# EAGLE design sdadapter (EAGLE 9.6.2)
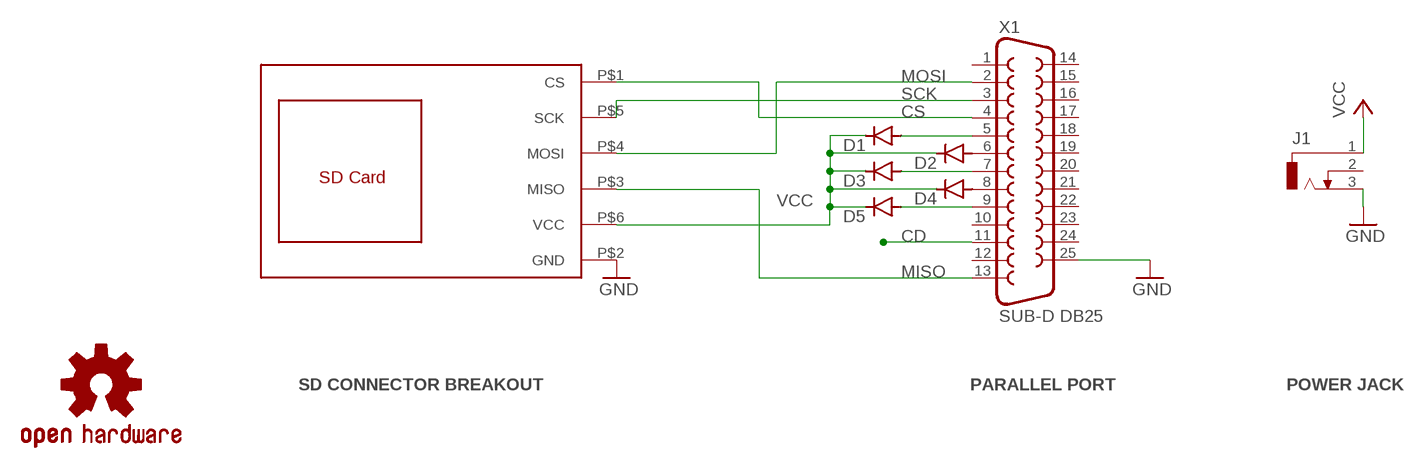
[diagram p0: schematic, sheet 1]

## Parts
D1  CGRM4001-G  [SOD-123_MINI-SMA]
D2  CGRM4001-G  [SOD-123_MINI-SMA]
D3  CGRM4001-G  [SOD-123_MINI-SMA]
D4  CGRM4001-G  [SOD-123_MINI-SMA]
D5  CGRM4001-G  [SOD-123_MINI-SMA]
J1  DCJ0303  [DCJ0303]
LOGO2  OSHW-LOGOS  [OSHW-LOGO-S]
U$1  SD_ADAPTER  [DEBO_MICRO_SD]
X1  SUB-D DB25  F25D  [F25D]

## Nets
CD: X1.11
CS: U$1.P$1(CS) X1.4
GND: J1.3 U$1.P$2(GND) X1.25
MISO: U$1.P$3(MISO) X1.13
MOSI: U$1.P$4(MOSI) X1.2
N$1: D1.A X1.5
N$2: D2.A X1.6
N$3: D3.A X1.7
N$4: D4.A X1.8
N$5: D5.A X1.9
SCK: U$1.P$5(SCK) X1.3
VCC: D1.C D2.C D3.C D4.C D5.C J1.1 U$1.P$6(VCC)
Unconnected: J1.2 X1.1 X1.10 X1.12 X1.14 X1.15 X1.16 X1.17 X1.18 X1.19 X1.20 X1.21 X1.22 X1.23 X1.24

## Notes on the sheet
- SD CONNECTOR BREAKOUT | PARALLEL PORT | POWER JACK

## Library data of the parts
D1-D5 = diode:CGRM400*-G: Molded plasitc,JEDEC SOD-123/Mini SMA Source: Comchip CGRM4001-G.pdf
J1 = con-jack:DCJ0303: DC POWER JACK Source: DCJ0303.pdf; OC_FARNELL: unknown; OC_NEWARK: unknown
LOGO2 = SparkFun-Aesthetics:OSHW-LOGO: Open Source Hardware Logo This logo indicates the piece of hardware it is found on incorporates a OSHW license and/or adheres to the definition of open source hardware found here: http://freedomdefined.org/OSHW
U$1 = sd_adapter:SD_ADAPTER
X1 = con-subd:F25: SUB-D; OC_FARNELL: unknown; OC_NEWARK: unknown

## Board
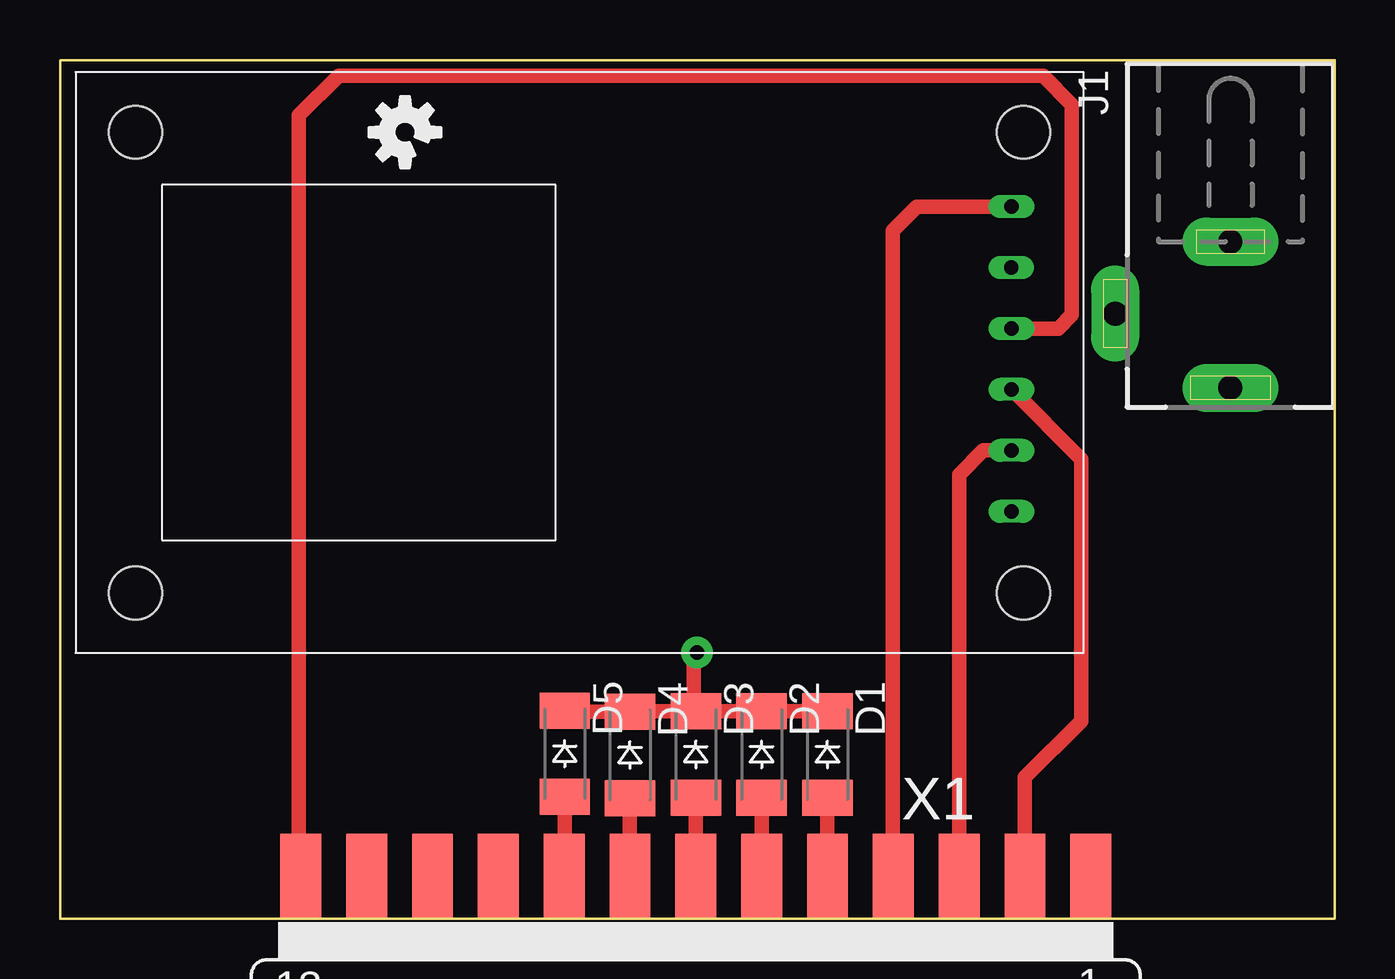
[diagram p1: board, top side]
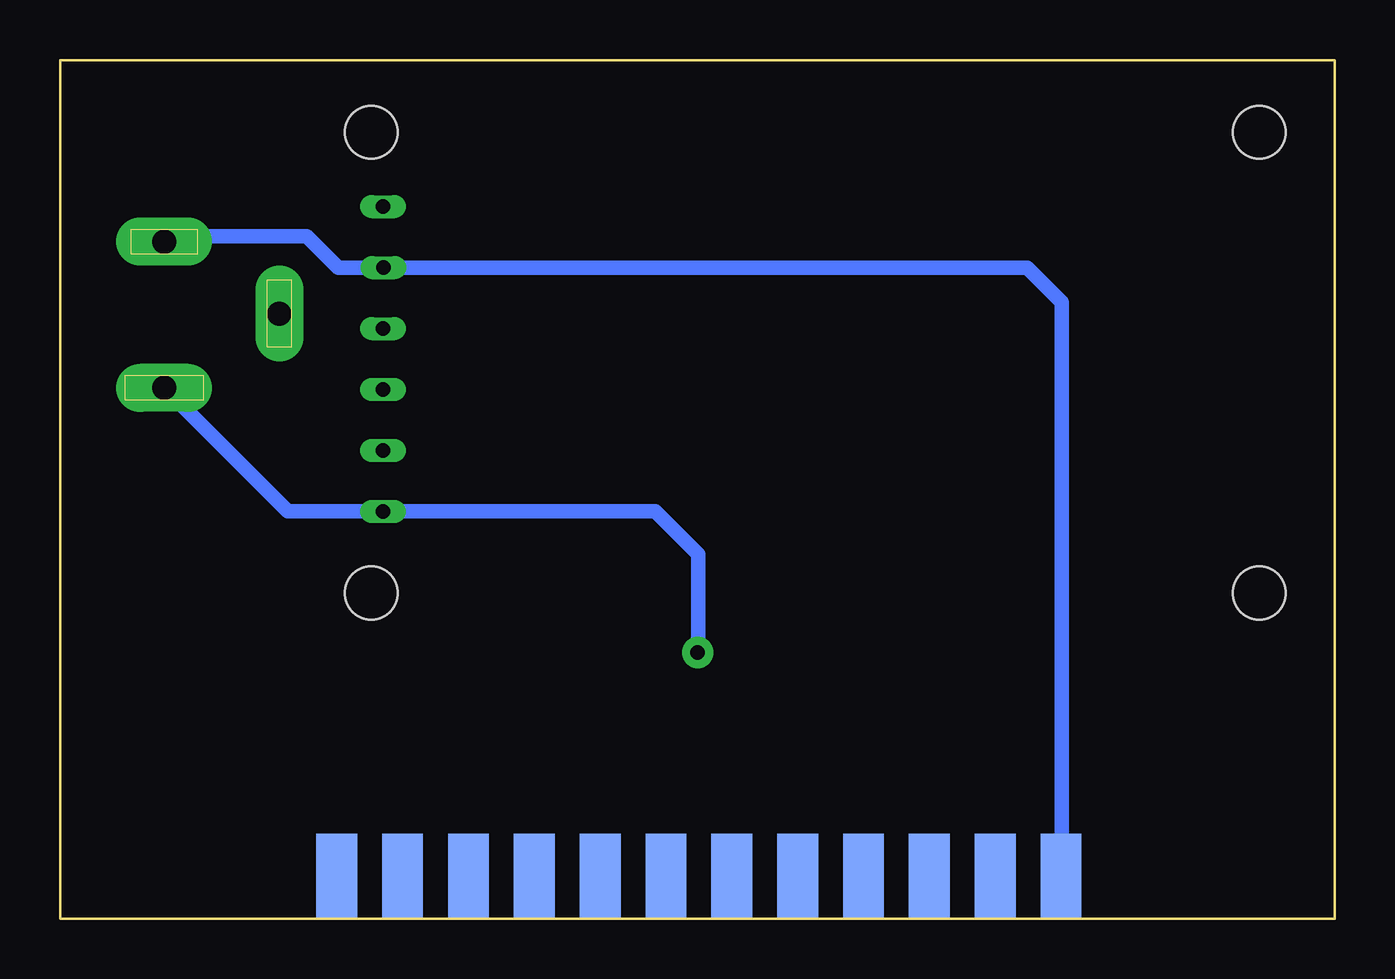
[diagram p2: board, bottom side, seen from below]

Size 53.11 x 35.79 mm. Coordinates in mm from the lower left corner, seen from the top.
Outline: 0,0.03 0,35.76 0.03,35.79 53.11,35.79 53.11,0.03 53.09,0 0,0
Copper layers (1*16): Top 0.035mm / dielectric 1.5mm / Bottom 0.035mm
Design rules "SparkFun-2-layer-TIGHT": minimum track width 7mil, minimum drill 15mil, track to track 7mil, track to pad 7mil, pad to pad 7mil, via to via 7mil, smd to smd 7mil, copper to edge 7mil, drill to drill 7mil, minimum pad ring 7mil, minimum via ring 7mil, stop-mask expansion 4mil, vias tented up to drill 20mil, thermal gap 10mil

### Footprints (pad centres in the part's own frame; a part is rotated, then mirrored left to right if it is on the bottom)
SOD-123_MINI-SMA = smd 1.5 x 2.1: A 1.8,0; C -1.8,0
DCJ0303 = drill 1 pad 2 long: 1 0,3.1; 2 4.8,0; 3 0,-3
DEBO_MICRO_SD = drill 0.6 long: P$1 3,5.6; P$2 3.01,8.14; P$3 3,10.68; P$4 3,13.22; P$5 3,15.76; P$6 3,18.3 | hole 2.2: 2.5,2.5; 2.5,21.7; 39.5,21.7; 39.5,2.5
F25D = smd 1.7 x 3.5: 1 -16.459,-6.045; 2 -13.716,-6.045; 3 -10.973,-6.045; 4 -8.23,-6.045; 5 -5.486,-6.045; 6 -2.743,-6.045; 7 0,-6.045; 8 2.743,-6.045; 9 5.486,-6.045; 10 8.23,-6.045; 11 10.973,-6.045; 12 13.716,-6.045; 13 16.459,-6.045 | smd 1.7 x 3.5 bottom: 14 -15.088,-6.045; 15 -12.344,-6.045; 16 -9.601,-6.045; 17 -6.858,-6.045; 18 -4.115,-6.045; 19 -1.372,-6.045; 20 1.372,-6.045; 21 4.115,-6.045; 22 6.858,-6.045; 23 9.601,-6.045; 24 12.344,-6.045; 25 15.088,-6.045

### Placement (x,y rotation side)
D1  31.98,6.86 270 top
D2  29.24,6.86 270 top
D3  26.49,6.86 270 top
D4  23.75,6.83 270 top
D5  21.03,6.88 270 top
J1  48.77,25.22 180 top
LOGO2  14.38,32.78 45 top
U$1  42.65,35.28 180 top
X1  26.49,-4.24 180 top

### Tracks (layer width: path | path; a pad name or v marks a point on that pad's centre or on a via)
CD
  Top 0.406: X1.11 15.8,2.08
CS
  Top 0.406: X1.4 34.7,1.83 34.65,1.83
  Top 0.61: U$1.P$1 35.7,29.68 34.7,28.68 34.7,1.83
GND
  Bottom 0.406: X1.25 11.4,5.13 | 49.05,27.94 J1.3 48.54,28.45
  Bottom 0.61: 48.54,28.45 42.82,28.45 41.52,27.14 U$1.P$2 12.82,27.14 11.38,25.71 11.38,1.83 X1.25
MISO
  Top 0.406: 10.08,1.85 10.11,1.88 | 10.08,1.85 X1.13 | 9.96,1.98 10.08,1.85
  Top 0.61: U$1.P$3 41.59,24.6 42.16,25.17 42.16,33.93 40.97,35.13 11.61,35.13 9.96,33.48 9.96,1.98
MOSI
  Top 0.406: X1.2 40.16,1.85
  Top 0.61: U$1.P$4 42.55,19.16 42.55,8.23 40.21,5.89 X1.2
N$1
  Top 0.406: X1.5
  Top 0.61: D1.A X1.5
N$2
  Top 0.406: X1.6
  Top 0.61: D2.A X1.6
N$3
  Top 0.61: D3.A X1.7
N$4
  Top 0.406: X1.8
  Top 0.61: D4.A X1.8
N$5
  Top 0.406: 21.03,1.83 X1.9
  Top 0.61: D5.A 21.03,1.83
SCK
  Top 0.406: X1.3 37.44,1.83 37.31,1.83
  Top 0.61: U$1.P$5 38.47,19.52 37.46,18.52 X1.3
VCC  (via drill 0.6 pad 1.3)
  Top 0.178: D3.C 26.42,8.73
  Top 0.406: 23.77,8.66 D4.C | 21.08,8.63 D5.C | 26.42,10.97 v26.54,11.1
  Top 0.61: D1.C D2.C D3.C 23.77,8.66 | D4.C 21.08,8.63 | 26.42,8.73 26.42,10.97
  Bottom 0.406: 26.52,11.13 v26.54,11.1
  Bottom 0.61: J1.1 43.63,16.98 U$1.P$6 28.31,16.98 26.52,15.19 26.52,11.13

### Text on the board
tDocu: SDPP Module Adapter | github.com/nilseuropa/sdpp | !!! WARNING !!! / Populate barrier diodes / only if your port is / IEEE1284 compliant.